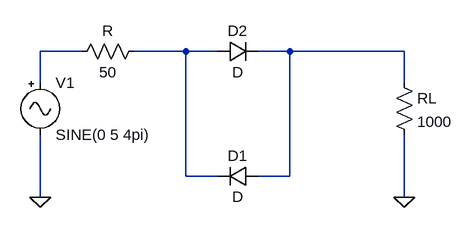
[diagram p0: schematic Draft2.asc]
Draft2.asc, the LTspice schematic file:
Version 4
SHEET 1 880 680
WIRE 32 96 -32 96
WIRE 192 96 112 96
WIRE 240 96 192 96
WIRE 352 96 304 96
WIRE 528 96 352 96
WIRE -32 144 -32 96
WIRE 528 144 528 96
WIRE 192 288 192 96
WIRE 240 288 192 288
WIRE 352 288 352 96
WIRE 352 288 304 288
WIRE -32 320 -32 224
WIRE 528 320 528 224
FLAG -32 320 0
FLAG 528 320 0
SYMBOL Misc\\signal -32 128 R0
WINDOW 123 0 0 Left 0
WINDOW 39 0 0 Left 0
SYMATTR InstName V1
SYMATTR Value SINE(0 5 4pi)
SYMBOL res 512 128 R0
SYMATTR InstName RL
SYMATTR Value 1000
SYMBOL diode 304 272 R90
WINDOW 0 0 32 VBottom 2
WINDOW 3 32 32 VTop 2
SYMATTR InstName D1
SYMBOL diode 240 112 R270
WINDOW 0 32 32 VTop 2
WINDOW 3 0 32 VBottom 2
SYMATTR InstName D2
SYMBOL res 128 80 R90
WINDOW 0 0 56 VBottom 2
WINDOW 3 32 56 VTop 2
SYMATTR InstName R
SYMATTR Value 50

The netlist it stands for:
* Draft2.asc
V1 N001 0 SINE(0 5 4pi)
RL N003 0 1000
D1 N003 N002 D
D2 N002 N003 D
R N002 N001 50
.model D D
.lib standard.dio
.backanno
.end